# EAGLE design ds32djg (EAGLE 4.11)

## Sheet 1 of 2
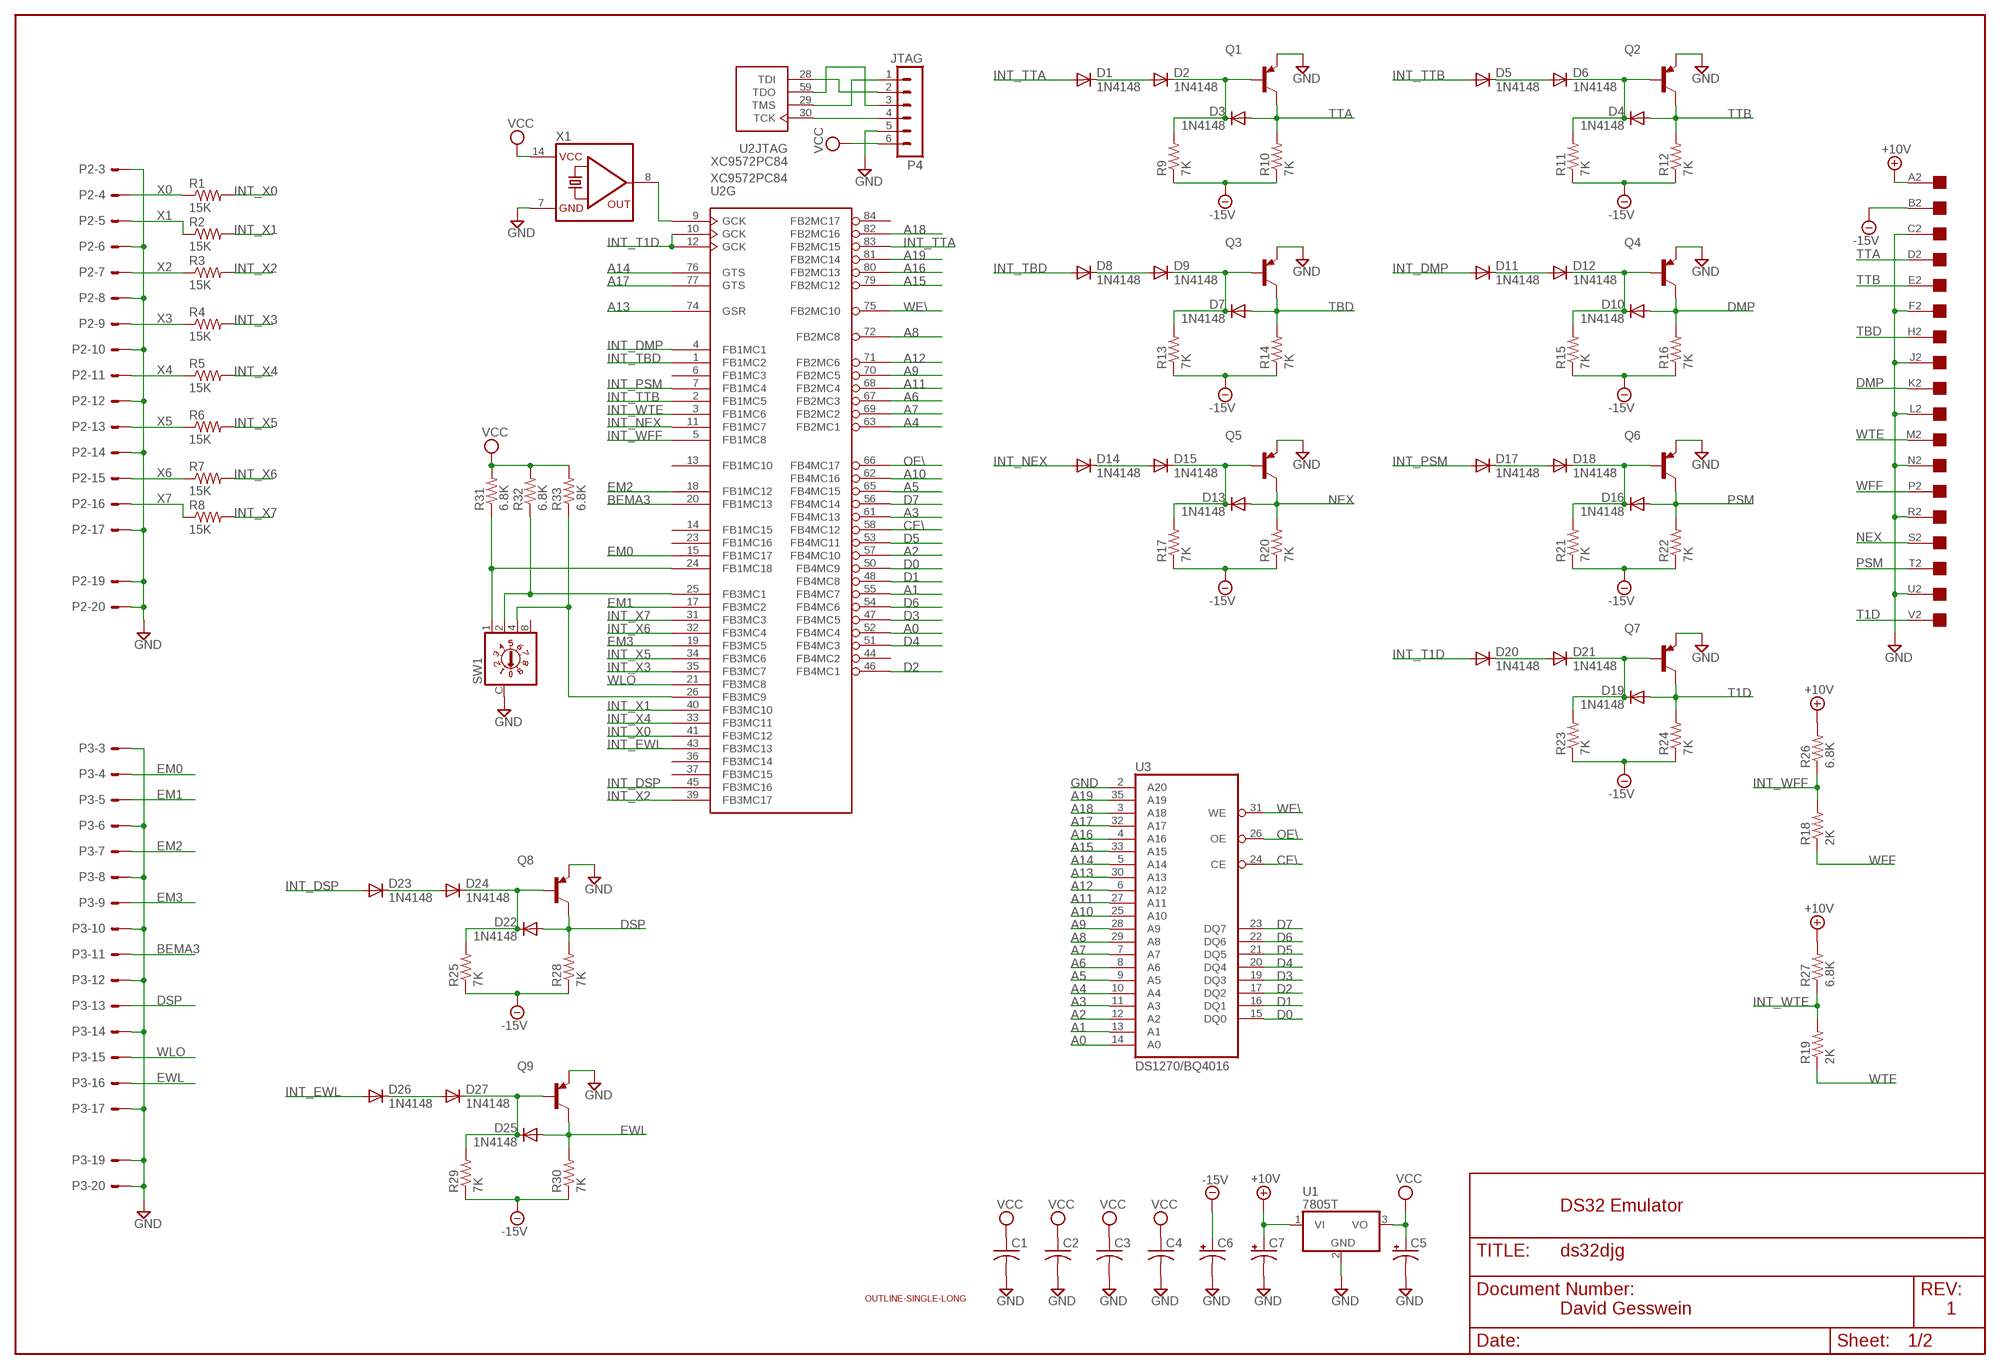
[diagram p0: schematic, sheet 1]

### Parts
C1  C-US050-025X075  [C050-025X075]
C2  C-US050-025X075  [C050-025X075]
C3  C-US050-025X075  [C050-025X075]
C4  C-US050-025X075  [C050-025X075]
C5  CPOL-USE15-5AXIAL  [E15-5]
C6  CPOL-USE15-5AXIAL  [E15-5]
C7  CPOL-USE15-5AXIAL  [E15-5]
D1  1N4148  [DO35-10]
D2  1N4148  [DO35-10]
D3  1N4148  [DO35-10]
D4  1N4148  [DO35-10]
D5  1N4148  [DO35-10]
D6  1N4148  [DO35-10]
D7  1N4148  [DO35-10]
D8  1N4148  [DO35-10]
D9  1N4148  [DO35-10]
D10  1N4148  [DO35-10]
D11  1N4148  [DO35-10]
D12  1N4148  [DO35-10]
D13  1N4148  [DO35-10]
D14  1N4148  [DO35-10]
D15  1N4148  [DO35-10]
D16  1N4148  [DO35-10]
D17  1N4148  [DO35-10]
D18  1N4148  [DO35-10]
D19  1N4148  [DO35-10]
D20  1N4148  [DO35-10]
D21  1N4148  [DO35-10]
D22  1N4148  [DO35-10]
D23  1N4148  [DO35-10]
D24  1N4148  [DO35-10]
D25  1N4148  [DO35-10]
D26  1N4148  [DO35-10]
D27  1N4148  [DO35-10]
P1  EDGE-1  [EDGE-CON1]
P2  ML20E  [ML20]
P3  ML20E  [ML20]
P4  JTAG  MA06-1  [MA06-1]
Q1  -PNP-TO92/  [TO92/]
Q2  -PNP-TO92/  [TO92/]
Q3  -PNP-TO92/  [TO92/]
Q4  -PNP-TO92/  [TO92/]
Q5  -PNP-TO92/  [TO92/]
Q6  -PNP-TO92/  [TO92/]
Q7  -PNP-TO92/  [TO92/]
Q8  -PNP-TO92/  [TO92/]
Q9  -PNP-TO92/  [TO92/]
R1  15K  R-US_0207/10  [0207/10]
R2  15K  R-US_0207/10  [0207/10]
R3  15K  R-US_0207/10  [0207/10]
R4  15K  R-US_0207/10  [0207/10]
R5  15K  R-US_0207/10  [0207/10]
R6  15K  R-US_0207/10  [0207/10]
R7  15K  R-US_0207/10  [0207/10]
R8  15K  R-US_0207/10  [0207/10]
R9  7K  R-US_0207/10  [0207/10]
R10  7K  R-US_0207/10  [0207/10]
R11  7K  R-US_0207/10  [0207/10]
R12  7K  R-US_0207/10  [0207/10]
R13  7K  R-US_0207/10  [0207/10]
R14  7K  R-US_0207/10  [0207/10]
R15  7K  R-US_0207/10  [0207/10]
R16  7K  R-US_0207/10  [0207/10]
R17  7K  R-US_0207/10  [0207/10]
R18  2K  R-US_0207/10  [0207/10]
R19  2K  R-US_0207/10  [0207/10]
R20  7K  R-US_0207/10  [0207/10]
R21  7K  R-US_0207/10  [0207/10]
R22  7K  R-US_0207/10  [0207/10]
R23  7K  R-US_0207/10  [0207/10]
R24  7K  R-US_0207/10  [0207/10]
R25  7K  R-US_0207/10  [0207/10]
R26  6.8K  R-US_0207/10  [0207/10]
R27  6.8K  R-US_0207/10  [0207/10]
R28  7K  R-US_0207/10  [0207/10]
R29  7K  R-US_0207/10  [0207/10]
R30  7K  R-US_0207/10  [0207/10]
R31  6.8K  R-US_0207/10  [0207/10]
R32  6.8K  R-US_0207/10  [0207/10]
R33  6.8K  R-US_0207/10  [0207/10]
SW1  DRR3010  [DRR3010]
U1  7805T  [TO220H]
U2  XC9572PC84  [PLCC-S84]
U3  DS1270/BQ4016  DS1270  [MIL740EXT36]
U$3  OUTLINE-SINGLE-LONG  [SINGLE-LONG]
X1  QG5860  [DIL14S]

### Nets
+10V [power]: C7.+ P1.A2 R26.2 R27.2 U1.1(VI)
-15V [power]: C6.+ P1.B2 R9.1 R10.1 R11.1 R12.1 R13.1 R14.1 R15.1 R16.1 R17.1 R20.1 R21.1 R22.1 R23.1 R24.1 R25.1 R28.1 R29.1 R30.1
A0 [power]: U2.52(G:FB4MC4) U3.14(A0)
A1 [power]: U2.55(G:FB4MC7) U3.13(A1)
A2 [power]: U2.57(G:FB4MC10) U3.12(A2)
A3 [power]: U2.61(G:FB4MC13) U3.11(A3)
A4 [power]: U2.63(G:FB2MC1) U3.10(A4)
A5 [power]: U2.65(G:FB4MC15) U3.9(A5)
A6 [power]: U2.67(G:FB2MC3) U3.8(A6)
A7 [power]: U2.69(G:FB2MC2) U3.7(A7)
A8 [power]: U2.72(G:FB2MC8) U3.29(A8)
A9 [power]: U2.70(G:FB2MC5) U3.28(A9)
A10 [power]: U2.62(G:FB4MC16) U3.25(A10)
A11 [power]: U2.68(G:FB2MC4) U3.27(A11)
A12 [power]: U2.71(G:FB2MC6) U3.6(A12)
A13 [power]: U2.74(G:GSR) U3.30(A13)
A14 [power]: U2.76(G:GTS) U3.5(A14)
A15 [power]: U2.79(G:FB2MC12) U3.33(A15)
A16 [power]: U2.80(G:FB2MC13) U3.4(A16)
A17 [power]: U2.77(G:GTS) U3.32(A17)
A18 [power]: U2.82(G:FB2MC16) U3.3(A18)
A19 [power]: U2.81(G:FB2MC14) U3.35(A19)
BEMA3: P3.11 U2.20(G:FB1MC13)
CE\ [power]: U2.58(G:FB4MC12) U3.24(CE)
D0 [power]: U2.50(G:FB4MC9) U3.15(DQ0)
D1 [power]: U2.48(G:FB4MC8) U3.16(DQ1)
D2 [power]: U2.46(G:FB4MC1) U3.17(DQ2)
D3 [power]: U2.47(G:FB4MC5) U3.19(DQ3)
D4 [power]: U2.51(G:FB4MC3) U3.20(DQ4)
D5 [power]: U2.53(G:FB4MC11) U3.21(DQ5)
D6 [power]: U2.54(G:FB4MC6) U3.22(DQ6)
D7 [power]: U2.56(G:FB4MC14) U3.23(DQ7)
DMP: D10.A P1.K2 Q4.3(C) R16.2
DSP: D22.A P3.13 Q8.3(C) R28.2
EM0: P3.4 U2.15(G:FB1MC17)
EM1: P3.5 U2.17(G:FB3MC2)
EM2: P3.7 U2.18(G:FB1MC12)
EM3: P3.9 U2.19(G:FB3MC5)
EWL: D25.A P3.16 Q9.3(C) R30.2
GND [power]: C1.2 C2.2 C3.2 C4.2 C5.- C6.- C7.- P1.C2 P1.F2 P1.J2 P1.L2 P1.N2 P1.R2 P1.U2 P2.3 P2.6 P2.8 P2.10 P2.12 P2.14 P2.17 P2.19 P2.20 P3.3 P3.6 P3.8 P3.10 P3.12 P3.14 P3.17 P3.19 P3.20 P4.5 Q1.1(E) Q2.1(E) Q3.1(E) Q4.1(E) Q5.1(E) Q6.1(E) Q7.1(E) Q8.1(E) Q9.1(E) SW1.C U1.2(GND) U3.2(A20) X1.7(GND)
INT_DMP: D11.A U2.4(G:FB1MC1)
INT_DSP [power]: D23.A U2.45(G:FB3MC16)
INT_EWL [power]: D26.A U2.43(G:FB3MC13)
INT_NEX: D14.A U2.11(G:FB1MC7)
INT_PSM: D17.A U2.7(G:FB1MC4)
INT_T1D: D20.A U2.10(G:GCK) U2.12(G:GCK)
INT_TBD: D8.A U2.1(G:FB1MC2)
INT_TTA: D1.A U2.83(G:FB2MC15)
INT_TTB: D5.A U2.2(G:FB1MC5)
INT_WFF: R18.2 R26.1 U2.5(G:FB1MC8)
INT_WTE: R19.2 R27.1 U2.3(G:FB1MC6)
INT_X0 [power]: R1.2 U2.41(G:FB3MC12)
INT_X1 [power]: R2.2 U2.40(G:FB3MC10)
INT_X2 [power]: R3.2 U2.39(G:FB3MC17)
INT_X3 [power]: R4.2 U2.35(G:FB3MC7)
INT_X4 [power]: R5.2 U2.33(G:FB3MC11)
INT_X5 [power]: R6.2 U2.34(G:FB3MC6)
INT_X6 [power]: R7.2 U2.32(G:FB3MC4)
INT_X7 [power]: R8.2 U2.31(G:FB3MC3)
N$1 [power]: P4.1 U2.29(JTAG:TMS)
N$2 [power]: P4.2 U2.28(JTAG:TDI)
N$3 [power]: P4.4 U2.30(JTAG:TCK)
N$4 [power]: P4.3 U2.59(JTAG:TDO)
N$5 [power]: U2.9(G:GCK) X1.8(OUT)
N$6 [power]: D1.C D2.A
N$7 [power]: D2.C D3.C Q1.2(B) R9.2
N$8 [power]: D23.C D24.A
N$9 [power]: D22.C D24.C Q8.2(B) R25.2
N$10 [power]: D5.C D6.A
N$11 [power]: D4.C D6.C Q2.2(B) R11.2
N$12 [power]: D26.C D27.A
N$13 [power]: D25.C D27.C Q9.2(B) R29.2
N$14 [power]: D8.C D9.A
N$15 [power]: D7.C D9.C Q3.2(B) R13.2
N$17 [power]: R31.1 SW1.1 U2.24(G:FB1MC18)
N$18 [power]: D11.C D12.A
N$19 [power]: D10.C D12.C Q4.2(B) R15.2
N$20 [power]: R32.1 SW1.2 U2.25(G:FB3MC1)
N$21 [power]: R33.1 SW1.4 U2.26(G:FB3MC9)
N$22 [power]: D14.C D15.A
N$23 [power]: D13.C D15.C Q5.2(B) R17.2
N$26 [power]: D17.C D18.A
N$27 [power]: D16.C D18.C Q6.2(B) R21.2
N$30 [power]: D20.C D21.A
N$31 [power]: D19.C D21.C Q7.2(B) R23.2
NEX: D13.A P1.S2 Q5.3(C) R20.2
OE\ [power]: U2.66(G:FB4MC17) U3.26(OE)
PSM: D16.A P1.T2 Q6.3(C) R22.2
T1D: D19.A P1.V2 Q7.3(C) R24.2
TBD: D7.A P1.H2 Q3.3(C) R14.2
TTA: D3.A P1.D2 Q1.3(C) R10.2
TTB: D4.A P1.E2 Q2.3(C) R12.2
VCC [power]: C1.1 C2.1 C3.1 C4.1 C5.+ P4.6 R31.2 R32.2 R33.2 U1.3(VO) X1.14(VCC)
WE\ [power]: U2.75(G:FB2MC10) U3.31(WE)
WFF: P1.P2 R18.1
WLO: P3.15 U2.21(G:FB3MC8)
WTE: P1.M2 R19.1
X0: P2.4 R1.1
X1: P2.5 R2.1
X2: P2.7 R3.1
X3: P2.9 R4.1
X4: P2.11 R5.1
X5: P2.13 R6.1
X6: P2.15 R7.1
X7: P2.16 R8.1
Unconnected: P2.1 P2.2 P2.18 P3.1 P3.2 P3.18 SW1.8 U2.6(G:FB1MC3) U2.13(G:FB1MC10) U2.14(G:FB1MC15) U2.23(G:FB1MC16) U2.36(G:FB3MC14) U2.37(G:FB3MC15) U2.44(G:FB4MC2) U2.84(G:FB2MC17)

### Notes on the sheet
- DS32 Emulator
- David Gesswein | 1

## Sheet 2 of 2
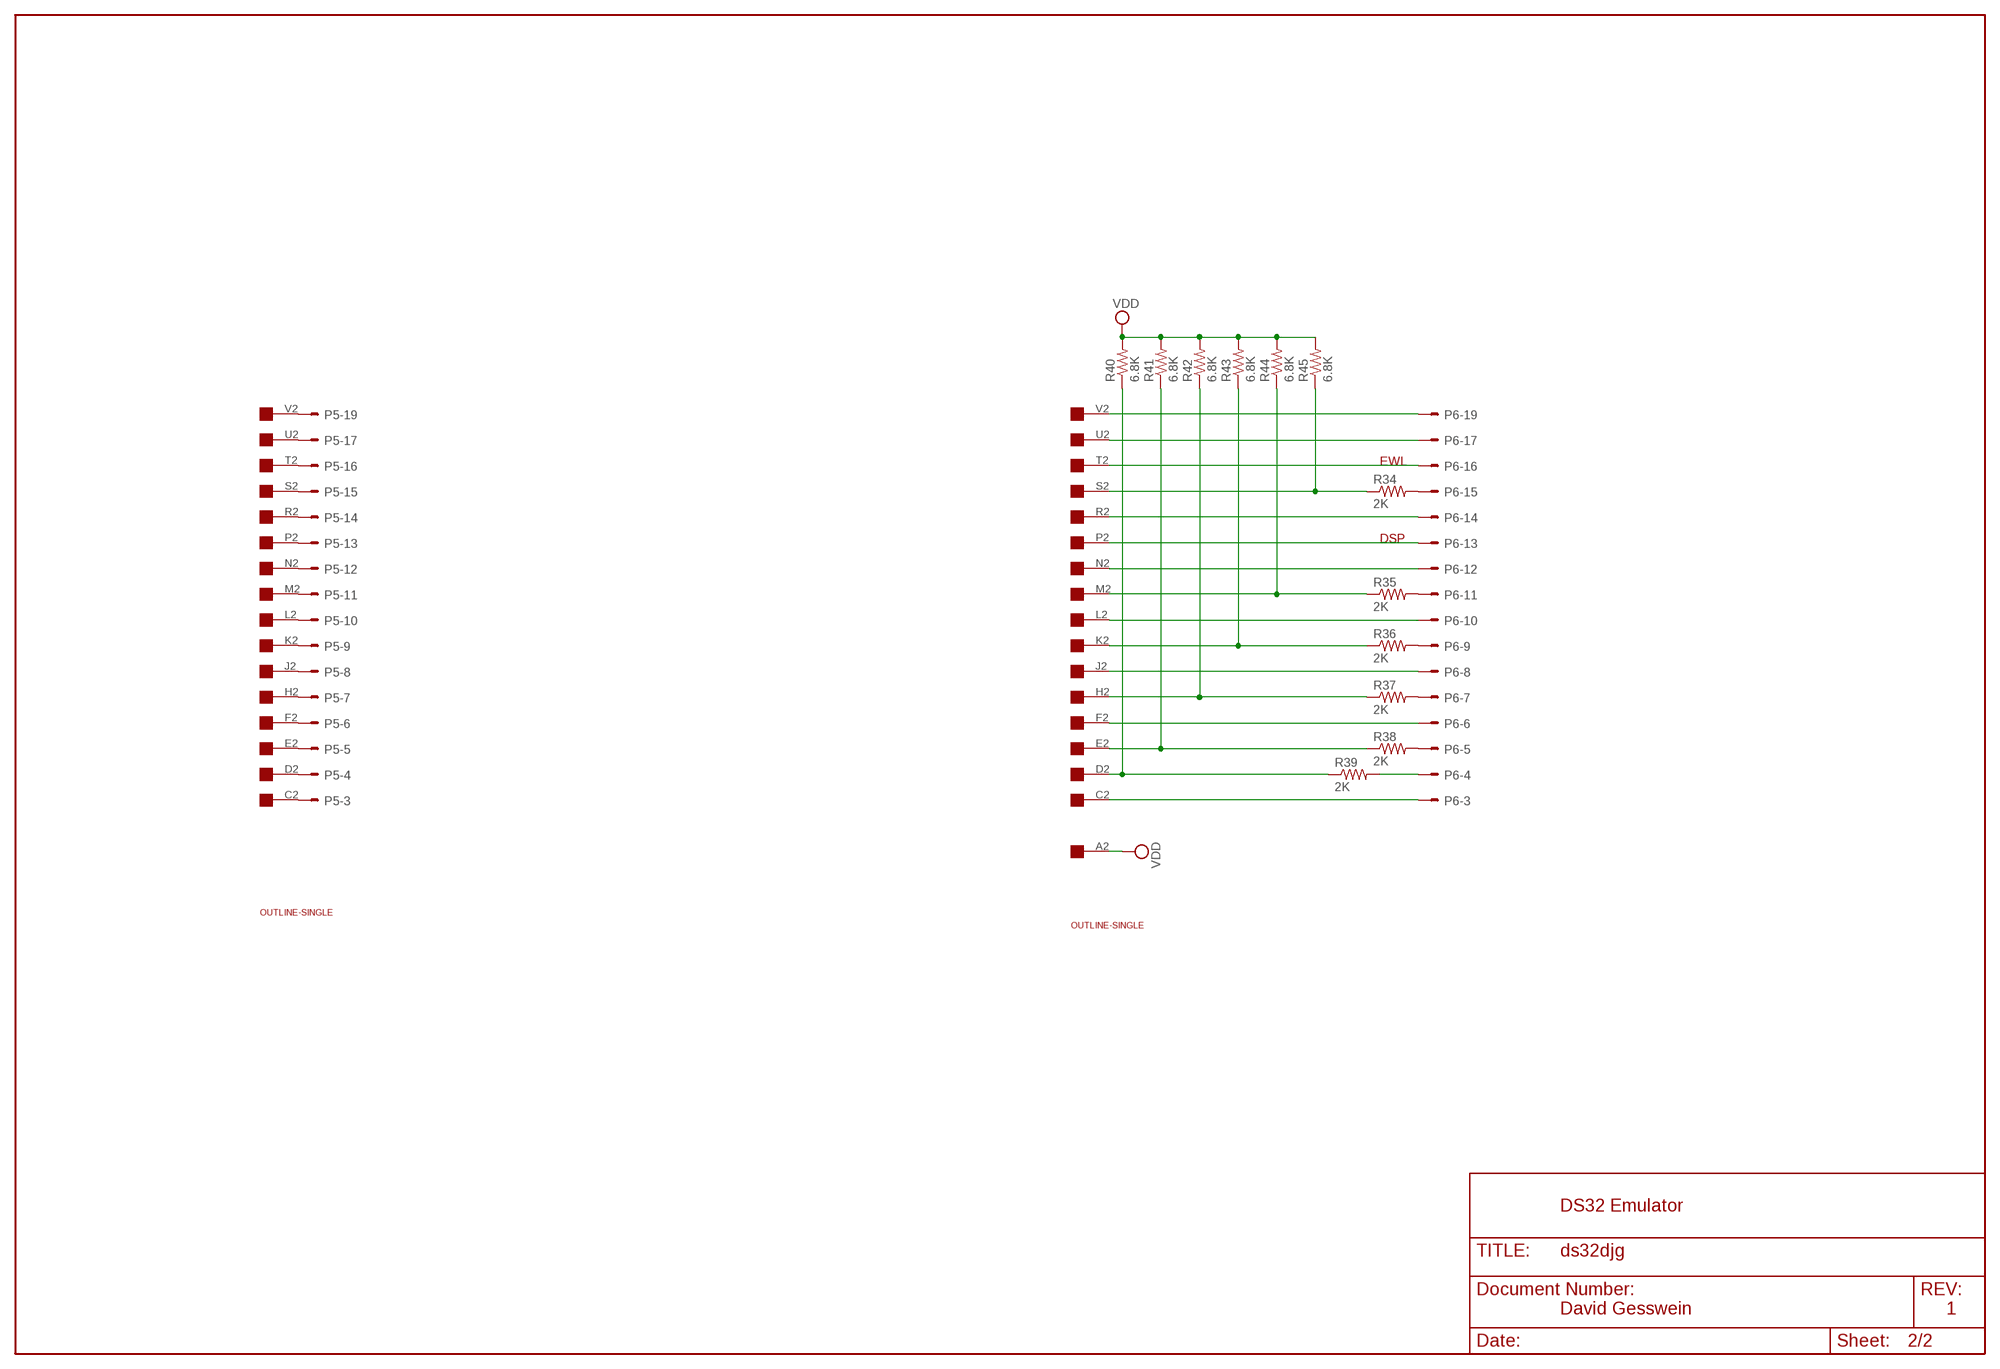
[diagram p1: schematic, sheet 2]

### Parts
P5  ML20E  [ML20]
P6  ML20E  [ML20]
R34  2K  R-US_0207/10  [0207/10]
R35  2K  R-US_0207/10  [0207/10]
R36  2K  R-US_0207/10  [0207/10]
R37  2K  R-US_0207/10  [0207/10]
R38  2K  R-US_0207/10  [0207/10]
R39  2K  R-US_0207/10  [0207/10]
R40  6.8K  R-US_0207/10  [0207/10]
R41  6.8K  R-US_0207/10  [0207/10]
R42  6.8K  R-US_0207/10  [0207/10]
R43  6.8K  R-US_0207/10  [0207/10]
R44  6.8K  R-US_0207/10  [0207/10]
R45  6.8K  R-US_0207/10  [0207/10]
U$1  EDGE-1  [EDGE-CON1]
U$2  EDGE-1  [EDGE-CON1]
U$4  OUTLINE-SINGLE  [SINGLE]
U$5  OUTLINE-SINGLE  [SINGLE]

### Nets
N$16 [power]: P6.3 U$2.C2
N$24 [power]: P5.3 U$1.C2
N$25 [power]: P5.4 U$1.D2
N$28 [power]: P5.5 U$1.E2
N$29 [power]: P5.6 U$1.F2
N$32 [power]: P5.7 U$1.H2
N$33 [power]: P5.8 U$1.J2
N$34 [power]: P5.9 U$1.K2
N$35 [power]: P5.10 U$1.L2
N$36 [power]: P5.11 U$1.M2
N$37 [power]: P5.12 U$1.N2
N$38 [power]: P5.13 U$1.P2
N$39 [power]: P5.14 U$1.R2
N$40 [power]: P5.15 U$1.S2
N$41 [power]: P5.16 U$1.T2
N$42 [power]: P5.17 U$1.U2
N$43 [power]: P5.19 U$1.V2
N$44 [power]: P6.6 U$2.F2
N$45 [power]: P6.8 U$2.J2
N$46 [power]: P6.10 U$2.L2
N$47 [power]: P6.12 U$2.N2
N$48 [power]: P6.14 U$2.R2
N$49 [power]: P6.19 U$2.V2
N$50 [power]: P6.17 U$2.U2
N$51 [power]: P6.16 U$2.T2
N$52 [power]: P6.13 U$2.P2
N$53 [power]: P6.15 R34.2
N$54 [power]: P6.11 R35.2
N$55 [power]: P6.9 R36.2
N$56 [power]: P6.7 R37.2
N$57 [power]: P6.5 R38.2
N$58 [power]: P6.4 R39.2
N$59 [power]: R39.1 R40.1 U$2.D2
N$60 [power]: R38.1 R41.1 U$2.E2
N$61 [power]: R37.1 R42.1 U$2.H2
N$62 [power]: R36.1 R43.1 U$2.K2
N$63 [power]: R35.1 R44.1 U$2.M2
N$64 [power]: R34.1 R45.1 U$2.S2
VDD [power]: R40.2 R41.2 R42.2 R43.2 R44.2 R45.2 U$2.A2
Unconnected: P5.1 P5.2 P5.18 P5.20 P6.1 P6.2 P6.18 P6.20 U$1.A2 U$1.B2 U$2.B2

### Notes on the sheet
- EWL
- DSP
- DS32 Emulator
- David Gesswein | 1

## Power pins joined to a net without a drawn wire
GND: U2.8(P:GND) U2.16(P:GND) U2.27(P:GND) U2.42(P:GND) U2.49(P:GND) U2.60(P:GND) U3.18(GND)
VCC: U2.22(P:VCC) U2.38(P:VCC) U2.64(P:VCC) U2.73(P:VCC) U2.78(P:VCC) U3.36(VCC)

## Library data of the parts
C1-C4 = rcl:C-US: CAPACITOR, American symbol
C5-C7 = rcl:CPOL-US: POLARIZED CAPACITOR, American symbol
D1-D27 = diode:1N4148: DIODE high speed (Philips)
P1 U$1 U$2 = dec-con:EDGE-1: Single-Sided DEC Edge Connector -- (side 2)
P2 P3 P5 P6 = con-harting-ml:ML20?E: HARTING
P4 = con-lstb:MA06-1: PIN HEADER
Q1-Q9 = transistor:*-PNP-: PNP Transistror
R1-R45 = rcl:R-US_: RESISTOR, American symbol
SW1 = switch-dil:DRR3010: DIL/CODE SWITCH
U1 = linear:78*: Positive VOLTAGE REGULATOR
U2 = xl_cpld:XC9572PC84
U3 = maxim-7:DS1270: DS1270 and similar NVRAM
U$3-U$5 = dec-con:OUTLINE-*: Board outlines for DEC boards.
X1 = crystal:QG5860: CRYSTAL RESONATOR

## Net classes
1 power: width 0.508 mm

## Board
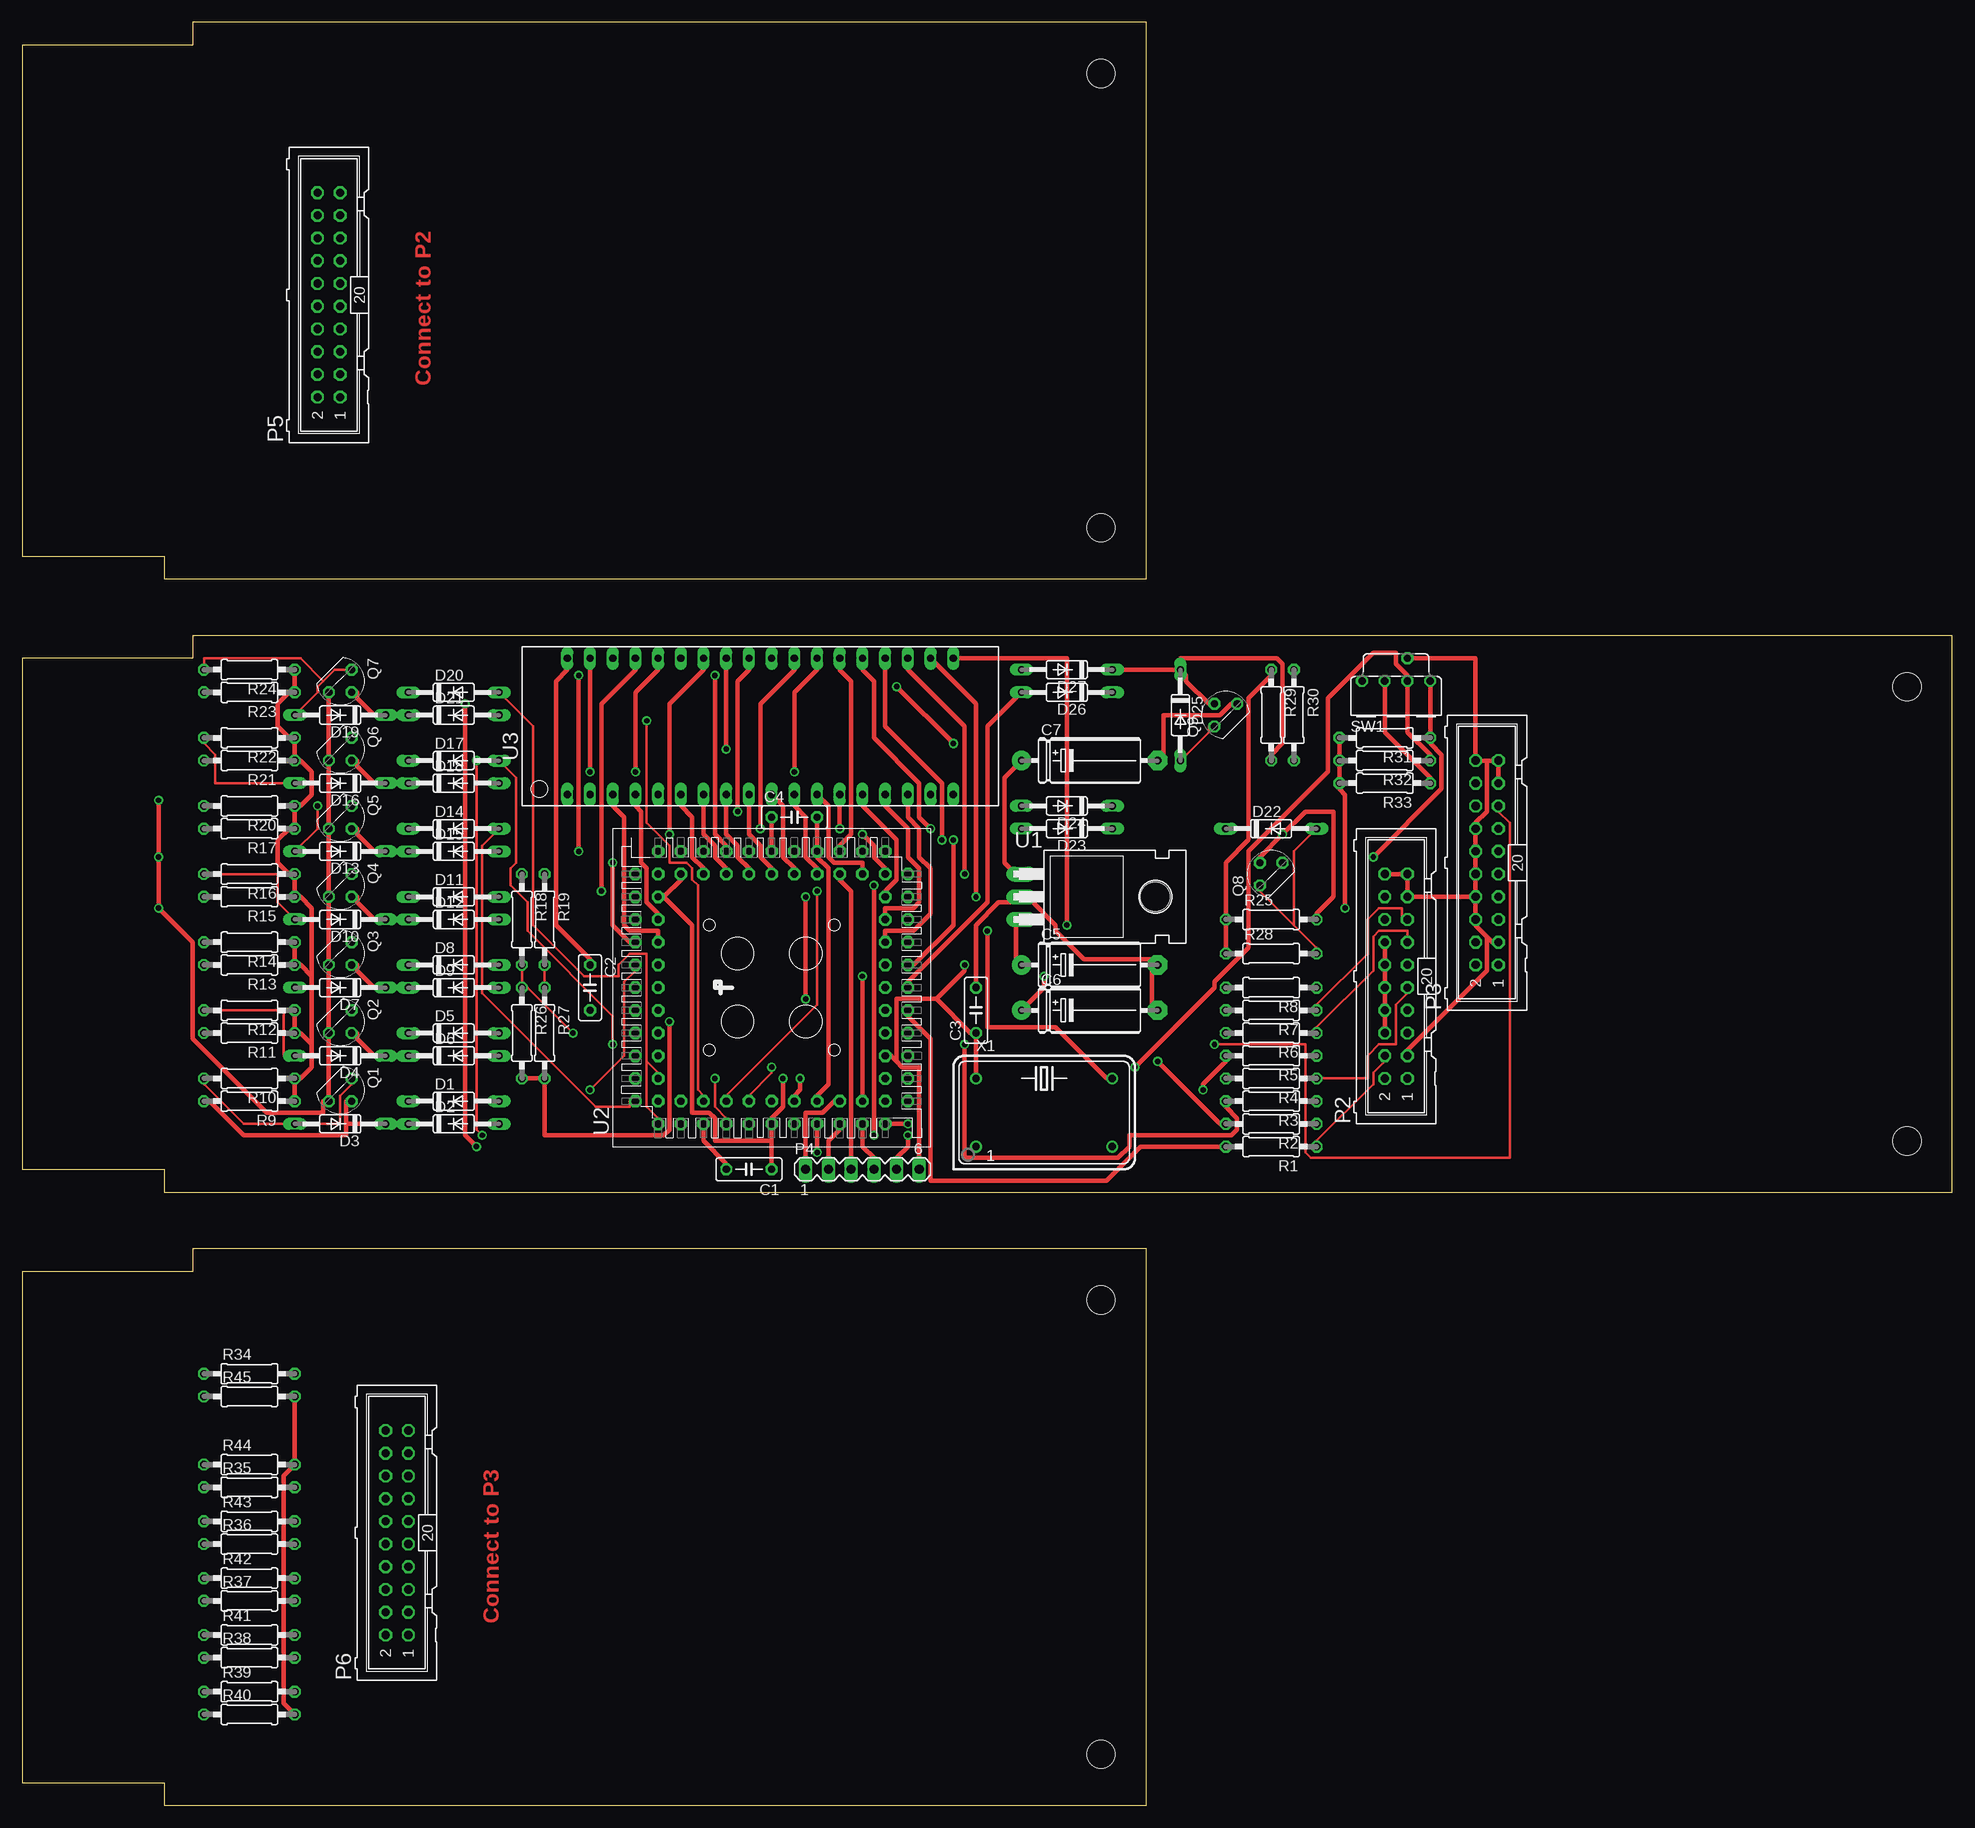
[diagram p2: board, top side]
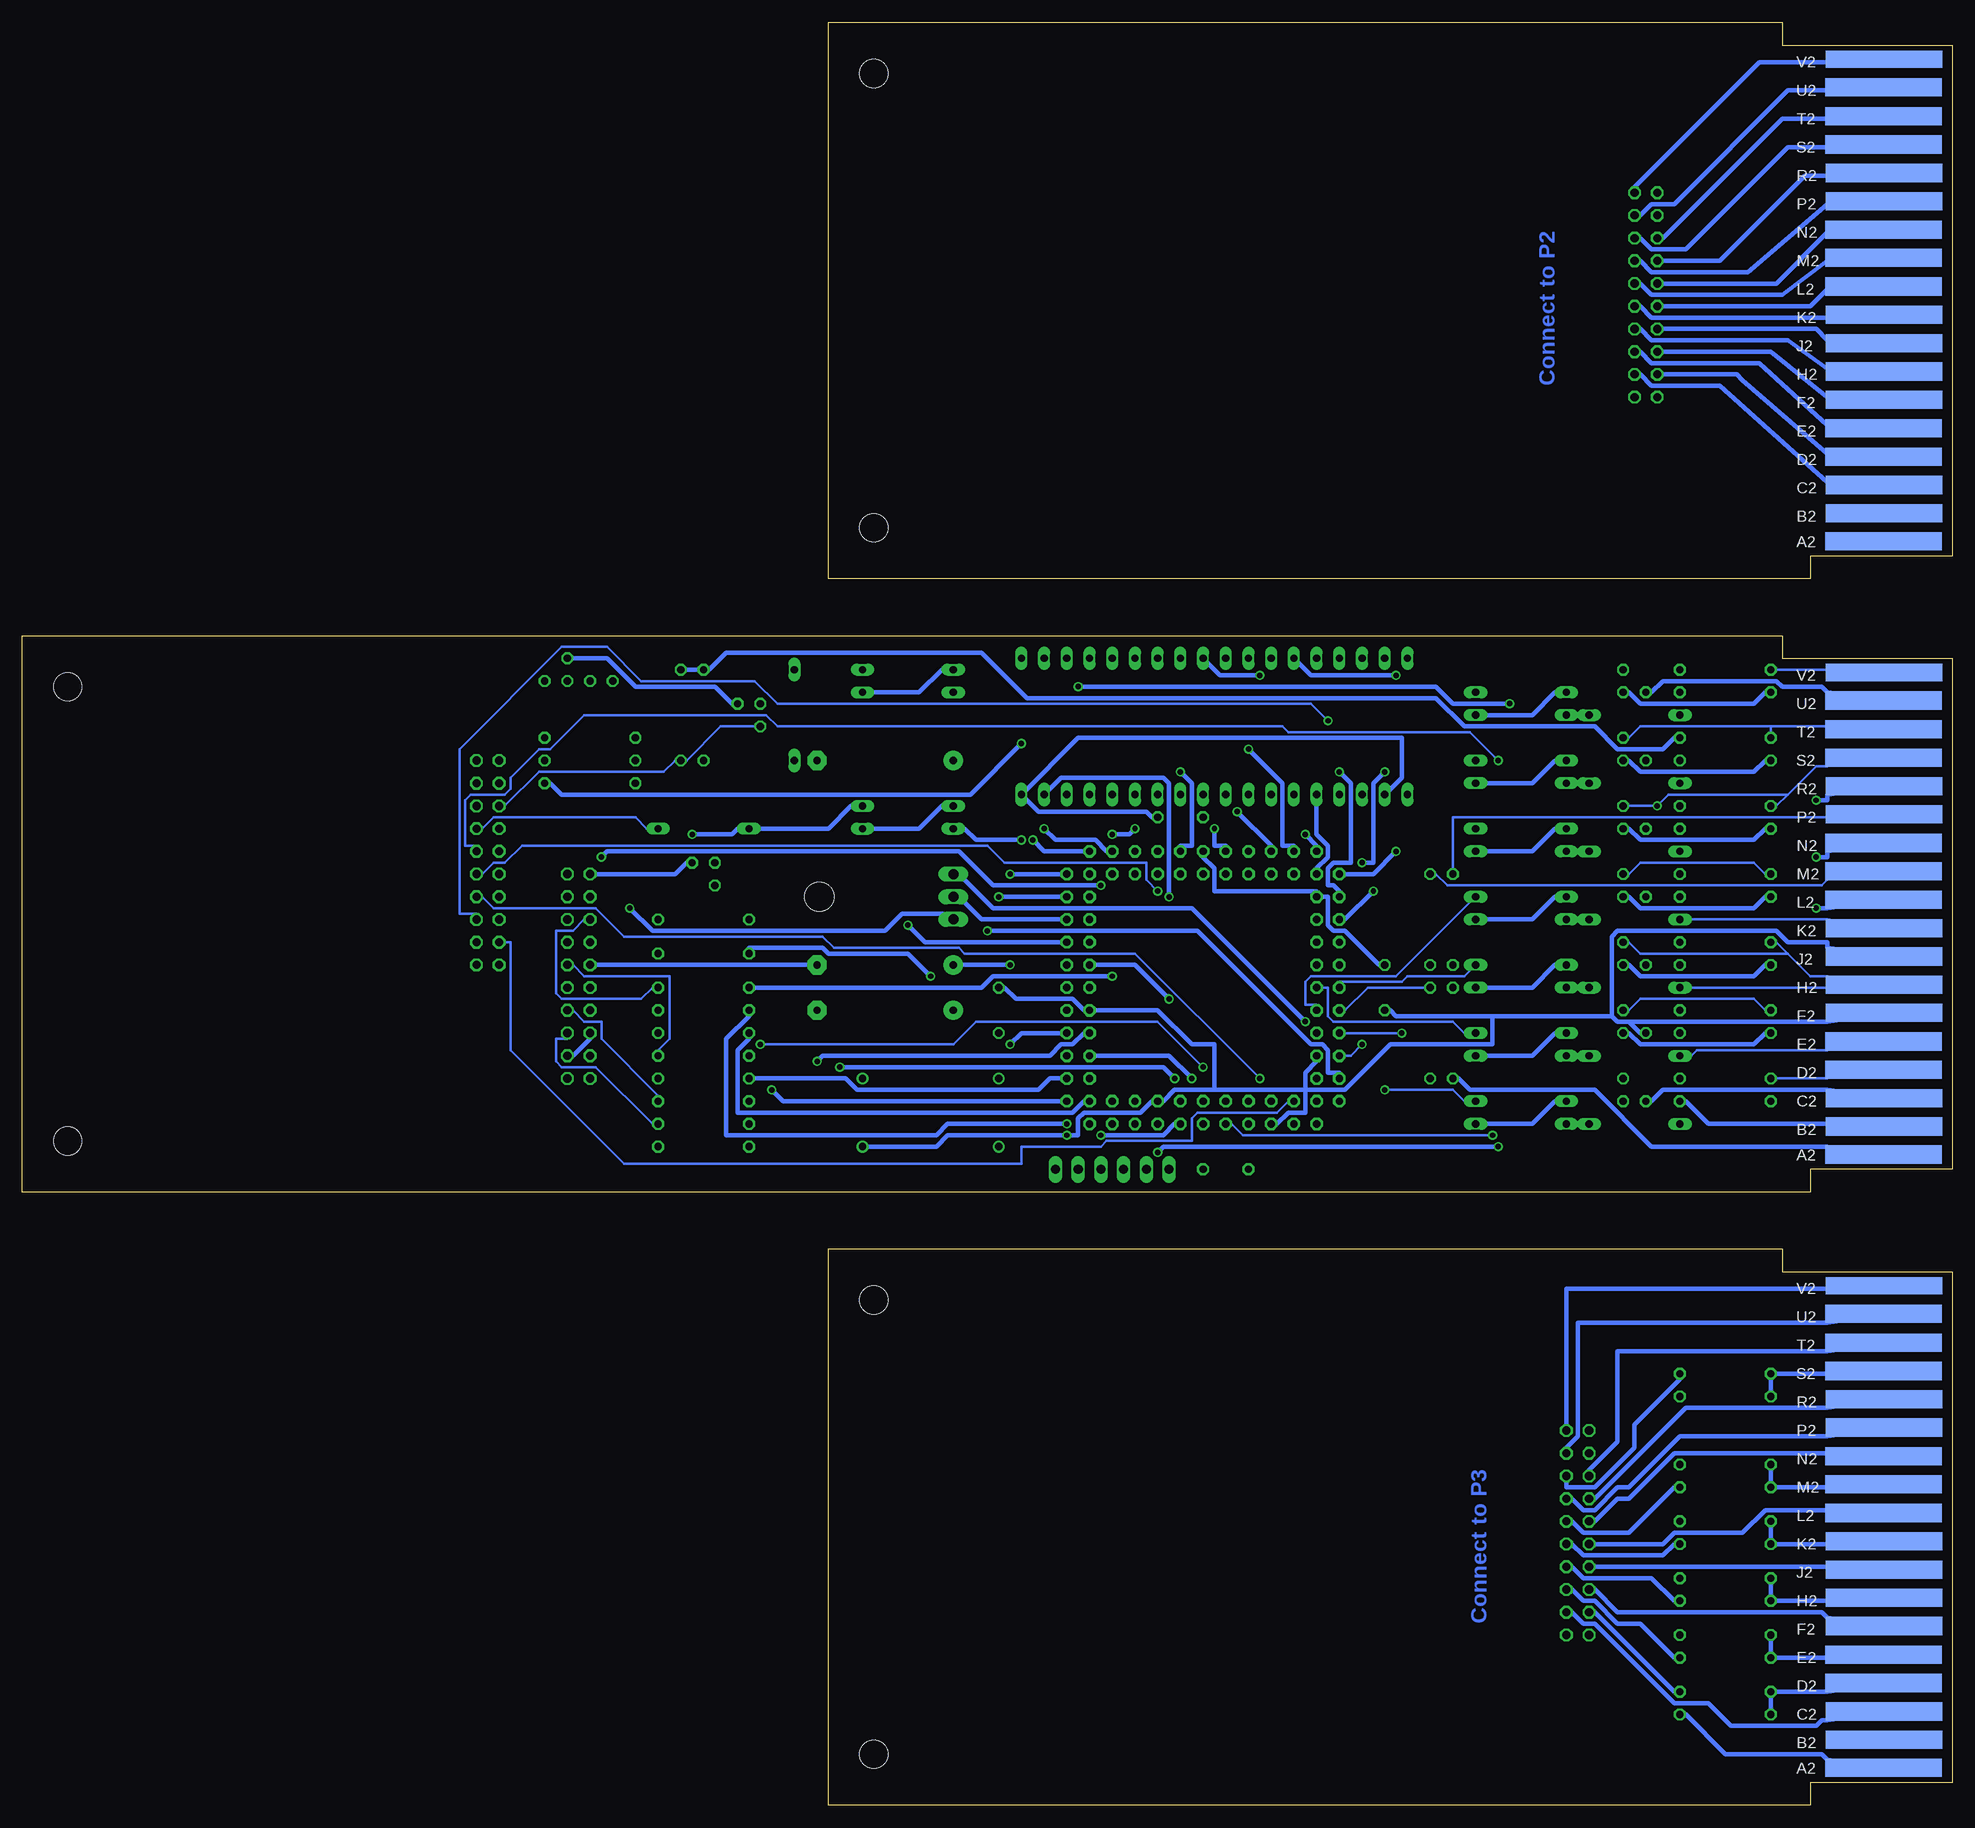
[diagram p3: board, bottom side, seen from below]

Size 215.9 x 199.39 mm. Coordinates in mm from the lower left corner, seen from the top.
Copper layers (1*16): Top 0.035mm / dielectric 1.5mm / Bottom 0.035mm
Design rules "10mils": minimum track width 10mil, minimum drill 24mil, track to track 10mil, track to pad 10mil, pad to pad 10mil, via to via 10mil, smd to smd 10mil, copper to edge 25mil, drill to drill 10mil, minimum pad ring 10mil, minimum via ring 8mil, stop-mask expansion 0mil, vias tented up to drill 0mil, thermal gap 10mil

### Footprints (pad centres in the part's own frame; a part is rotated, then mirrored left to right if it is on the bottom)
C050-025X075 = drill 0.813 octagon: 1 -2.54,0; 2 2.54,0
E15-5 = drill 0.813 pad 2.159 round: + -7.62,0 | drill 0.813 pad 2.159 octagon: - 7.62,0
DO35-10 = drill 0.813 long: A 5.08,0; C -5.08,0
EDGE-CON1 = smd 13.017 x 2.032 bottom: A2 7.69,4.194; B2 7.668,7.328; C2 7.668,10.49; D2 7.693,13.665; E2 7.693,16.84; F2 7.642,20.041; H2 7.642,23.19; J2 7.668,26.34; K2 7.668,29.515; L2 7.693,32.69; M2 7.693,35.89; N2 7.693,39.04; P2 7.668,42.24; R2 7.668,45.39; S2 7.693,48.565; T2 7.693,51.74; U2 7.693,54.966 | smd 13.017 x 1.905 bottom: V2 7.668,58.102
ML20 = drill 0.914 octagon: 1 -11.43,-1.27; 2 -11.43,1.27; 3 -8.89,-1.27; 4 -8.89,1.27; 5 -6.35,-1.27; 6 -6.35,1.27; 7 -3.81,-1.27; 8 -3.81,1.27; 9 -1.27,-1.27; 10 -1.27,1.27; 11 1.27,-1.27; 12 1.27,1.27; 13 3.81,-1.27; 14 3.81,1.27; 15 6.35,-1.27; 16 6.35,1.27; 17 8.89,-1.27; 18 8.89,1.27; 19 11.43,-1.27; 20 11.43,1.27
MA06-1 = drill 1.016 long: 1 -6.35,0; 2 -3.81,0; 3 -1.27,0; 4 1.27,0; 5 3.81,0; 6 6.35,0
TO92/ = drill 0.813 octagon: 1 1.27,-1.27; 2 1.27,1.27; 3 -1.27,1.27
0207/10 = drill 0.813 octagon: 1 -5.08,0; 2 5.08,0
DRR3010 = drill 0.813 octagon: 1 3.81,0; 2 1.27,0; 4 -1.27,0; 8 -3.81,0; C 1.27,2.54
TO220H = drill 1.118 long: 1 -2.54,-10.16; 2 0,-10.16; 3 2.54,-10.16 | hole 3.302: 0,4.826
PLCC-S84 = drill 0.813 pad 1.397 octagon: 1 0,15.24; 2 0,12.7; 3 -2.54,15.24; 4 -2.54,12.7; 5 -5.08,15.24; 6 -5.08,12.7; 7 -7.62,15.24; 8 -7.62,12.7; 9 -10.16,15.24; 10 -10.16,12.7; 11 -12.7,15.24; 12 -15.24,12.7; 13 -12.7,12.7; 14 -15.24,10.16; 15 -12.7,10.16; 16 -15.24,7.62; 17 -12.7,7.62; 18 -15.24,5.08; 19 -12.7,5.08; 20 -15.24,2.54; 21 -12.7,2.54; 22 -15.24,0; 23 -12.7,0; 24 -15.24,-2.54; 25 -12.7,-2.54; 26 -15.24,-5.08; 27 -12.7,-5.08; 28 -15.24,-7.62; 29 -12.7,-7.62; 30 -15.24,-10.16; 31 -12.7,-10.16; 32 -15.24,-12.7; 33 -12.7,-15.24; 34 -12.7,-12.7; 35 -10.16,-15.24; 36 -10.16,-12.7; 37 -7.62,-15.24; 38 -7.62,-12.7; 39 -5.08,-15.24; 40 -5.08,-12.7; 41 -2.54,-15.24; 42 -2.54,-12.7; 43 0,-15.24; 44 0,-12.7; 45 2.54,-15.24; 46 2.54,-12.7; 47 5.08,-15.24; 48 5.08,-12.7; 49 7.62,-15.24; 50 7.62,-12.7; 51 10.16,-15.24; 52 10.16,-12.7; 53 12.7,-15.24; 54 15.24,-12.7; 55 12.7,-12.7; 56 15.24,-10.16; 57 12.7,-10.16; 58 15.24,-7.62; 59 12.7,-7.62; 60 15.24,-5.08; 61 12.7,-5.08; 62 15.24,-2.54; 63 12.7,-2.54; 64 15.24,0; 65 12.7,0; 66 15.24,2.54; 67 12.7,2.54; 68 15.24,5.08; 69 12.7,5.08; 70 15.24,7.62; 71 12.7,7.62; 72 15.24,10.16; 73 12.7,10.16; 74 15.24,12.7; 75 12.7,15.24; 76 12.7,12.7; 77 10.16,15.24; 78 10.16,12.7; 79 7.62,15.24; 80 7.62,12.7; 81 5.08,15.24; 82 5.08,12.7; 83 2.54,15.24; 84 2.54,12.7
MIL740EXT36 = drill 0.813 long: 1 -20.32,-7.62; 2 -17.78,-7.62; 3 -15.24,-7.62; 4 -12.7,-7.62; 5 -10.16,-7.62; 6 -7.62,-7.62; 7 -5.08,-7.62; 8 -2.54,-7.62; 9 0,-7.62; 10 2.54,-7.62; 11 5.08,-7.62; 12 7.62,-7.62; 13 10.16,-7.62; 14 12.7,-7.62; 15 15.24,-7.62; 16 17.78,-7.62; 17 20.32,-7.62; 18 22.86,-7.62; 19 22.86,7.62; 20 20.32,7.62; 21 17.78,7.62; 22 15.24,7.62; 23 12.7,7.62; 24 10.16,7.62; 25 7.62,7.62; 26 5.08,7.62; 27 2.54,7.62; 28 0,7.62; 29 -2.54,7.62; 30 -5.08,7.62; 31 -7.62,7.62; 32 -10.16,7.62; 33 -12.7,7.62; 34 -15.24,7.62; 35 -17.78,7.62; 36 -20.32,7.62
SINGLE-LONG = hole 3.175: 210.82,56.515; 210.82,5.715
SINGLE = hole 3.175: 120.65,56.515; 120.65,5.715
DIL14S = drill 0.813 round: 1 -7.62,-3.81; 7 7.62,-3.81; 8 7.62,3.81; 14 -7.62,3.81

### Placement (x,y rotation side)
C1  81.28,71.12 180 top
C2  63.5,91.44 270 top
C3  106.68,88.9 90 top
C4  86.36,110.49 0 top
C5  119.38,93.98 0 top
C6  119.38,88.9 0 top
C7  119.38,116.84 0 top
D1  48.26,78.74 0 top
D2  48.26,76.2 0 top
D3  35.56,76.2 180 top
D4  35.56,83.82 180 top
D5  48.26,86.36 0 top
D6  48.26,83.82 0 top
D7  35.56,91.44 180 top
D8  48.26,93.98 0 top
D9  48.26,91.44 0 top
D10  35.56,99.06 180 top
D11  48.26,101.6 0 top
D12  48.26,99.06 0 top
D13  35.56,106.68 180 top
D14  48.26,109.22 0 top
D15  48.26,106.68 0 top
D16  35.56,114.3 180 top
D17  48.26,116.84 0 top
D18  48.26,114.3 0 top
D19  35.56,121.92 180 top
D20  48.26,124.46 0 top
D21  48.26,121.92 0 top
D22  139.7,109.22 0 top
D23  116.84,109.22 180 top
D24  116.84,111.76 180 top
D25  129.54,121.92 270 top
D26  116.84,124.46 180 top
D27  116.84,127 180 top
P1  0,68.58 0 top
P2  153.67,92.71 90 top
P3  163.83,105.41 90 top
P4  93.98,71.12 0 top
P5  34.29,168.91 90 top
P6  41.91,30.48 90 top
Q1  35.56,80.01 270 top
Q2  35.56,87.63 270 top
Q3  35.56,95.25 270 top
Q4  35.56,102.87 270 top
Q5  35.56,110.49 270 top
Q6  35.56,118.11 270 top
Q7  35.56,125.73 270 top
Q8  139.7,104.14 90 top
Q9  134.62,121.92 90 top
R1  139.7,73.66 180 top
R2  139.7,76.2 180 top
R3  139.7,78.74 180 top
R4  139.7,81.28 180 top
R5  139.7,83.82 180 top
R6  139.7,86.36 180 top
R7  139.7,88.9 180 top
R8  139.7,91.44 180 top
R9  25.4,78.74 180 top
R10  25.4,81.28 180 top
R11  25.4,86.36 180 top
R12  25.4,88.9 180 top
R13  25.4,93.98 180 top
R14  25.4,96.52 180 top
R15  25.4,101.6 180 top
R16  25.4,104.14 180 top
R17  25.4,109.22 180 top
R18  55.88,99.06 270 top
R19  58.42,99.06 270 top
R20  25.4,111.76 180 top
R21  25.4,116.84 180 top
R22  25.4,119.38 180 top
R23  25.4,124.46 180 top
R24  25.4,127 180 top
R25  139.7,99.06 0 top
R26  55.88,86.36 270 top
R27  58.42,86.36 270 top
R28  139.7,95.25 0 top
R29  139.7,121.92 270 top
R30  142.24,121.92 270 top
R31  152.4,119.38 180 top
R32  152.4,116.84 180 top
R33  152.4,114.3 180 top
R34  25.4,48.26 0 top
R35  25.4,35.56 0 top
R36  25.4,29.21 0 top
R37  25.4,22.86 0 top
R38  25.4,16.51 0 top
R39  25.4,12.7 0 top
R40  25.4,10.16 0 top
R41  25.4,19.05 0 top
R42  25.4,25.4 0 top
R43  25.4,31.75 0 top
R44  25.4,38.1 0 top
R45  25.4,45.72 0 top
SW1  153.67,125.73 0 top
U1  121.92,101.6 270 top
U2  83.82,91.44 90 top
U3  81.28,120.65 0 top
U$1  0,137.16 0 top
U$2  0,0 0 top
U$3  0,68.58 0 top
U$4  0,0 0 top
U$5  0,137.16 0 top
X1  114.3,77.47 0 top

### Tracks (layer width: path | path; a pad name or v marks a point on that pad's centre or on a via)
+10V  (via drill 0.61)
  Top 0.508: U1.1 110.49,104.78 109.86,105.41 109.86,114.94 C7.+ | R26.2 R27.2 58.42,74.93 71.76,74.93 72.39,75.56 v72.39,87.63
  Bottom 0.508: R26.2 55.25,81.28 53.98,80.01 40.01,80.01 33.66,73.66 13.97,73.66 P1.A2 | v72.39,87.63 85.09,100.33 107.32,100.33 110.49,103.5 U1.1
-15V  (via drill 0.61)
  Top 0.508: R28.1 R25.1 134.62,105.41 137.16,107.95 137.16,123.82 139.7,126.36 R29.1 | v114.3,92.71 114.3,91.44 C6.+ | R24.1 R23.1 29.85,124.46 28.58,123.19 28.58,120.65 29.85,119.38 R22.1 R21.1 31.12,116.84 32.39,115.57 32.39,113.03 31.12,111.76 R20.1 R17.1 29.85,109.22 28.58,107.95 28.58,105.41 29.85,104.14 R16.1 R15.1 31.12,101.6 32.39,100.33 32.39,92.71 | R14.1 R13.1 31.12,93.98 32.39,92.71 | R9.1 R10.1 31.12,81.28 32.39,82.55 32.39,85.09 | R12.1 R11.1 31.12,86.36 32.39,85.09 | 32.39,85.09 32.39,92.71
  Bottom 0.508: R30.1 R29.1 139.07,127 137.16,128.91 108.59,128.91 103.51,123.82 57.79,123.82 54.61,120.65 40.01,120.65 37.47,118.11 32.39,118.11 31.12,119.38 R22.1 | v114.3,92.71 116.84,95.25 125.73,95.25 126.37,95.88 134.62,95.88 R28.1 | P1.B2 13.97,76.2 27.31,76.2 29.85,78.74 R9.1
A0
  Top 0.508: U3.14 93.98,111.76 97.79,107.95 97.79,103.5 96.52,102.23 U2.52
A1  (via drill 0.61)
  Top 0.508: v93.98,108.59 95.25,107.31 95.25,106.05 96.52,104.78 U2.55 | v91.44,109.22 U3.13
  Bottom 0.508: v91.44,109.22 92.08,108.59 v93.98,108.59
A2
  Top 0.508: U3.12 90.17,111.76 90.17,106.05 90.81,105.41 93.98,105.41 U2.57
A3
  Top 0.508: U3.11 86.36,111.76 87.63,110.49 87.63,106.05 88.9,104.78 U2.61
A4
  Top 0.508: U3.10 85.09,111.76 85.09,106.05 86.36,104.78 U2.63
A5
  Top 0.508: U3.9 81.28,108.59 82.55,107.31 82.55,106.05 83.82,104.78 U2.65
A6
  Top 0.508: U3.8 78.74,108.59 80.01,107.31 80.01,106.05 81.28,104.78 U2.67
A7
  Top 0.508: U3.7 76.2,108.59 77.47,107.31 77.47,106.05 78.74,104.78 U2.69
A8  (via drill 0.61)
  Top 0.508: v78.74,118.11 U3.29
  Bottom 0.508: v78.74,118.11 74.93,114.3 74.93,107.31 73.66,107.31 U2.72
A9  (via drill 0.61)
  Top 0.508: v80.01,111.12 80.01,125.73 81.28,127 U3.28
  Bottom 0.508: v80.01,111.12 76.2,107.31 U2.70
A10  (via drill 0.61)
  Top 0.508: v86.36,115.57 86.36,124.46 88.9,127 U3.25
  Bottom 0.508: v86.36,115.57 85.09,114.3 85.09,107.31 86.36,107.31 U2.62
A11  (via drill 0.61)
  Top 0.508: v77.47,126.36 77.47,108.59 78.74,107.31 U2.68
  Bottom 0.508: v77.47,126.36 81.92,126.36 U3.27
A12
  Top 0.508: U3.6 73.66,111.76 74.93,110.49 74.93,106.05 76.2,104.78 U2.71
A13  (via drill 0.61)
  Top 0.508: v72.39,108.59 72.39,123.19 76.2,127 U3.30
  Bottom 0.508: v72.39,108.59 71.12,107.31 U2.74
A14
  Bottom 0.508: U3.5 71.12,108.59 69.85,107.31 69.85,106.05 71.12,104.78 U2.76
A15  (via drill 0.61)
  Top 0.508: v64.77,102.23 64.77,123.19 68.58,127 U3.33
  Bottom 0.508: v64.77,102.23 67.95,99.06 U2.79
A16
  Top 0.508: U3.4 68.58,111.76 69.22,111.12 69.22,105.41 69.85,104.78 69.85,100.97 71.12,99.69 U2.80
A17  (via drill 0.61)
  Top 0.508: v68.58,115.57 68.58,124.46 71.12,127 U3.32
  Bottom 0.508: v68.58,115.57 67.31,114.3 67.31,105.41 69.22,105.41 69.85,104.78 69.85,102.87 69.22,102.87 68.58,102.23 U2.77
A18
  Top 0.508: U3.3 66.04,111.76 67.31,110.49 67.31,98.42 67.95,97.79 71.12,97.79 U2.82
A19  (via drill 0.61)
  Top 0.508: v66.04,105.41 66.04,98.42 67.95,96.52 U2.81 | v63.5,115.57 U3.35
  Bottom 0.508: v63.5,115.57 64.77,114.3 64.77,105.41 v66.04,105.41
BEMA3  (via drill 0.61)
  Top 0.254: v51.44,74.93 50.8,75.56 v50.8,116.84
  Bottom 0.254: v51.44,74.93 79.38,74.93 80.65,76.2 U2.20 | v50.8,116.84 53.98,120.02 74.3,120.02 74.93,120.65 131.45,120.65 132.72,121.92 153.04,121.92 156.85,118.11 158.12,118.11 161.29,114.94 161.29,113.66 161.93,113.03 165.74,113.03 166.37,112.39 166.37,107.31 165.1,107.31 P3.11
CE\
  Top 0.508: U3.24 91.44,127 92.71,125.73 92.71,108.59 91.44,107.31 U2.58
D0
  Top 0.508: U3.15 96.52,111.76 99.06,109.22 99.06,106.05 100.33,104.78 100.33,100.97 99.7,100.33 96.52,100.33 U2.50
D1
  Top 0.508: U3.16 99.06,110.49 100.33,109.22 100.33,106.05 101.6,104.78 101.6,99.69 99.7,97.79 96.52,97.79 U2.48
D2  (via drill 0.61)
  Top 0.508: v87.63,90.17 v87.63,101.6
  Bottom 0.508: v87.63,101.6 87.63,114.3 88.27,114.94 99.7,114.94 U3.17 | v87.63,90.17 91.44,93.98 U2.46
D3  (via drill 0.61)
  Top 0.508: v116.84,98.42 116.84,128.27 U3.19
  Bottom 0.508: v116.84,98.42 114.94,96.52 U2.47
D4  (via drill 0.61)
  Top 0.508: v106.68,101.6 106.68,123.19 U3.20
  Bottom 0.508: U2.51 v106.68,101.6
D5  (via drill 0.61)
  Top 0.508: v105.41,104.14 105.41,120.65 99.06,127 U3.21
  Bottom 0.508: U2.53 v105.41,104.14
D6  (via drill 0.61)
  Top 0.508: v102.87,107.95 102.87,114.3 96.52,120.65 U3.22
  Bottom 0.508: v102.87,107.95 101.6,106.68 U2.54
D7  (via drill 0.61)
  Top 0.508: v101.6,109.22 100.33,110.49 100.33,114.3 95.25,119.38 95.25,125.73 93.98,127 U3.23
  Bottom 0.508: v101.6,109.22 100.33,107.95 95.89,107.95 94.62,106.68 U2.56
DMP
  Top 0.254: R16.2 28.58,104.14 28.58,100.97 D10.A
  Bottom 0.254: D10.A 13.97,99.06 P1.K2 | Q4.3 36.2,104.14 34.93,105.41 22.23,105.41 20.96,104.14 R16.2
DSP
  Top 0.254: 142.24,98.42 144.78,95.88 R28.2 | 142.24,98.42 138.43,102.23 Q8.3 | 142.24,98.42 142.24,106.68 D22.A
  Bottom 0.254: P3.13 164.47,109.22 163.2,110.49 147.32,110.49 146.05,109.22 D22.A
EM0
  Bottom 0.254: U2.15 74.3,78.74 75.57,77.47 84.46,77.47 85.09,76.83 85.09,74.3 94.62,74.3 95.25,73.66 104.14,73.66 104.14,71.75 148.59,71.75 161.29,84.45 161.29,96.52 P3.4
EM1  (via drill 0.61)
  Top 0.254: v69.85,121.28 69.85,109.85 72.39,107.31 72.39,105.41 74.3,105.41 74.93,104.78 74.93,103.5 75.57,102.87 75.57,80.01 76.2,79.38 U2.17
  Bottom 0.254: v69.85,121.28 71.76,123.19 131.45,123.19 133.99,125.73 146.69,125.73 150.5,129.54 155.58,129.54 167.01,118.11 167.01,99.69 165.1,99.69 P3.5
EM2  (via drill 0.61)
  Top 0.254: v77.47,81.28 77.47,78.11 78.74,76.83 U2.18
  Bottom 0.254: v77.47,81.28 91.44,95.25 110.49,95.25 111.13,95.88 125.1,95.88 126.37,97.16 148.59,97.16 151.77,100.33 163.2,100.33 164.47,101.6 P3.7
EM3  (via drill 0.61)
  Top 0.254: v88.9,102.23 88.9,89.53 78.74,79.38 U2.19
  Bottom 0.254: v88.9,102.23 90.17,103.5 90.17,105.41 106.05,105.41 107.95,107.31 160.02,107.31 161.93,105.41 163.2,105.41 164.47,104.14 P3.9
EWL
  Top 0.254: D25.A 132.72,120.02 132.72,120.65 Q9.3
  Bottom 0.254: Q9.3 137.8,120.65 141.61,116.84 R30.2 142.88,116.84 144.15,115.57 158.12,115.57 161.93,111.76 P3.16
GND  (via drill 0.61)
  Top 0.508: Q7.1 Q6.1 Q5.1 Q4.1 Q3.1 Q2.1 Q1.1 33.66,78.74 33.66,77.47 27.31,77.47 19.05,85.72 19.05,96.52 v15.24,100.33 v15.24,106.05 v15.24,112.39 | P2.20 P2.19 P2.17 P3.8 | P2.6 P2.8 P2.10 P2.12 P2.14 | P3.8 P3.6 162.56,98.42 163.83,97.16 | 163.83,97.16 164.47,96.52 P3.3 | P3.8 P3.10 P3.12 P3.14 162.56,109.85 163.83,111.12 163.83,116.84 | 163.83,97.16 163.83,93.34 154.94,84.45 P2.3 | Q9.1 135.26,123.19 133.99,121.92 127.64,121.92 127.64,117.47 C7.- | P3.17 P3.19 163.83,116.84 | SW1.C 162.56,128.27 P3.20 163.83,116.84 | C4.2 U2.60 88.9,106.05 90.17,104.78 90.17,80.64 88.9,79.38 U2.27 | C1.2 78.74,71.75 76.2,74.3 U2.16 | v99.06,74.93 99.06,73.66 97.79,72.39 P4.5 | C6.- 126.37,89.53 126.37,93.34 C5.- 126.37,94.61 118.75,94.61 115.57,97.79 115.57,98.42 113.03,100.97 U1.2 110.49,100.97 109.22,100.97 106.68,98.42 C3.2
  Bottom 0.508: 38.1,88.27 51.44,88.27 | 51.44,88.27 62.23,88.27 62.87,88.9 C2.2 | 38.1,88.27 37.47,87.63 36.2,87.63 | 36.2,87.63 34.93,86.36 Q2.1 | P1.C2 13.97,80.01 32.39,80.01 33.66,78.74 Q1.1 | 36.2,87.63 13.97,87.63 P1.F2 | 38.1,88.27 38.1,97.16 37.47,97.79 19.69,97.79 18.42,96.52 13.97,96.52 13.97,95.88 P1.J2 | v15.24,100.33 13.97,100.33 P1.L2 | v15.24,106.05 13.97,106.05 13.97,106.68 P1.N2 | v15.24,112.39 13.97,112.39 13.97,113.03 P1.R2 | P1.U2 13.97,124.46 14.61,125.09 19.05,125.09 19.69,125.73 32.39,125.73 33.66,124.46 Q7.1 | Q8.1 141.61,105.41 142.88,104.14 P2.20 | P2.3 154.31,83.82 152.4,85.72 P2.6 | Q9.1 136.53,123.19 138.43,125.09 147.32,125.09 150.5,128.27 SW1.C | C3.2 106.05,91.44 104.78,90.17 98.43,90.17 97.16,88.9 U2.42 88.9,88.9 85.09,85.09 82.55,85.09 82.55,80.01 | 72.39,80.01 72.39,77.47 74.3,77.47 75.57,76.2 U2.16 | 72.39,80.01 72.39,81.91 71.12,83.19 U2.8 | 72.39,80.01 82.55,80.01 | 82.55,80.01 87,80.01 88.27,78.74 U2.27 89.54,78.74 90.81,77.47 97.16,77.47 97.79,76.83 97.79,74.93 v99.06,74.93 112.4,74.93 113.67,73.66 X1.7 | C5.- P2.12 | 51.44,88.27 51.44,85.09 62.87,85.09 67.95,80.01 72.39,80.01 | U2.49 108.59,99.06 110.49,100.97 U1.2 | U3.2 61.6,114.94 61.6,119.38 97.79,119.38 U3.18 102.24,111.12 90.17,111.12 89.54,110.49 C4.2
INT_DMP
  Bottom 0.254: D11.A 62.23,92.71 71.76,92.71 72.39,92.08 72.39,89.53 71.12,89.53 U2.4
INT_DSP  (via drill 0.61)
  Top 0.508: v104.14,107.95 104.14,98.42 99.7,93.98 U2.45
  Bottom 0.508: v104.14,107.95 109.22,107.95 110.49,109.22 D23.A
INT_EWL
  Top 0.508: D26.A 107.95,120.65 107.95,100.97 99.06,92.08 U2.43
INT_NEX
  Top 0.254: D14.A 51.44,107.31 51.44,90.81 64.14,78.11 67.95,78.11 67.95,78.74 U2.11
INT_PSM  (via drill 0.61)
  Top 0.254: v66.04,85.09 66.04,88.27 56.52,97.79 56.52,100.97 54.61,102.87 54.61,104.78 55.25,105.41 55.25,114.94 D17.A
  Bottom 0.254: v66.04,85.09 67.31,83.82 U2.7
INT_T1D
  Top 0.254: 69.85,83.19 69.85,95.25 67.95,95.25 66.68,93.98 66.68,92.71 62.87,92.71 57.15,98.42 57.15,120.65 D20.A | 69.85,83.19 71.12,81.91 U2.10 | 69.85,83.19 69.85,78.11 71.12,76.83 U2.12
INT_TBD
  Bottom 0.254: D8.A 54.61,92.71 60.96,92.71 61.6,92.08 68.58,92.08 U2.1
INT_TTA  (via drill 0.61)
  Top 0.254: v63.5,80.01 67.31,83.82 67.31,92.08 68.58,93.34 U2.83
  Bottom 0.254: v63.5,80.01 55.88,80.01 54.61,78.74 D1.A
INT_TTB
  Bottom 0.254: D5.A 54.61,86.36 55.88,87.63 69.22,87.63 69.85,88.27 69.85,91.44 U2.2
INT_WFF  (via drill 0.61)
  Top 0.254: R18.2 R26.1 56.52,91.44 v61.6,86.36
  Bottom 0.254: v61.6,86.36 U2.5
INT_WTE
  Top 0.254: R27.1 R19.2
  Bottom 0.254: U2.3 67.95,88.9 65.41,91.44 R27.1
INT_X0
  Top 0.508: R1.2 125.1,73.66 121.29,69.85 101.6,69.85 101.6,85.72 99.06,88.27 U2.41
INT_X1  (via drill 0.61)
  Top 0.508: v127,83.19 133.99,76.2 R2.2
  Bottom 0.508: v127,83.19 126.37,83.82 100.97,83.82 99.7,85.09 98.43,85.09 97.16,86.36 U2.40
INT_X2  (via drill 0.61)
  Top 0.508: v105.41,85.09 105.41,72.39 122.56,72.39 123.83,73.66 123.83,74.93 135.26,74.93 135.89,75.56 135.89,76.83 134.62,78.11 R3.2
  Bottom 0.508: v105.41,85.09 104.14,86.36 U2.39
INT_X3
  Bottom 0.508: R4.2 123.83,81.28 122.56,80.01 102.24,80.01 100.97,81.28 U2.35
INT_X4  (via drill 0.61)
  Top 0.508: v132.08,80.01 132.08,80.64 134.62,83.19 R5.2
  Bottom 0.508: v132.08,80.01 130.81,78.74 U2.33
INT_X5
  Bottom 0.508: R6.2 134.62,85.72 135.89,84.45 135.89,77.47 98.43,77.47 97.16,78.74 U2.34
INT_X6  (via drill 0.61)
  Top 0.508: U2.32 v99.06,76.2
  Bottom 0.508: v99.06,76.2 112.4,76.2 113.67,74.93 137.16,74.93 137.16,85.72 134.62,88.27 R7.2
INT_X7  (via drill 0.61)
  Top 0.508: U2.31 v93.98,92.71
  Bottom 0.508: v93.98,92.71 107.32,92.71 108.59,91.44 R8.2
N$1
  Top 0.508: U2.29 90.81,78.74 89.54,77.47 87.63,77.47 P4.1
N$2
  Top 0.508: U2.28 91.44,75.56 90.17,74.3 P4.2
N$3
  Top 0.508: U2.30 93.98,73.66 95.25,72.39 P4.4
N$4
  Top 0.508: U2.59 91.44,103.5 92.71,102.23 P4.3
N$5  (via drill 0.61)
  Top 0.508: v107.95,97.79 107.95,87 115.57,87 121.29,81.28 X1.8
  Bottom 0.508: v107.95,97.79 84.46,97.79 71.76,85.09 70.49,85.09 69.85,84.45 69.85,81.91 68.58,81.91 U2.9
N$6
  Bottom 0.508: D1.C 44.45,78.74 46.99,76.2 D2.A
N$7
  Top 0.508: D2.C D3.C 36.2,76.2 | 36.2,76.2 36.2,78.74 Q1.2 | 36.2,76.2 36.2,74.93 24.77,74.93 20.96,78.74 R9.2
N$8
  Bottom 0.508: D24.A 113.03,111.76 115.57,109.22 D23.C
N$9  (via drill 0.61)
  Top 0.508: Q8.2 138.43,106.05 v140.97,108.59 143.51,111.12 146.69,111.12 146.69,101.6 144.78,99.69 R25.2
  Bottom 0.508: D24.C 123.19,111.76 125.73,109.22 D22.C 135.89,109.22 136.53,108.59 v140.97,108.59
N$10
  Bottom 0.508: D5.C 44.45,86.36 46.99,83.82 D6.A
N$11
  Top 0.508: D6.C D4.C 39.37,83.82 37.47,85.72 37.47,86.36 Q2.2
  Bottom 0.508: R11.2 20.96,86.36 22.23,85.09 34.93,85.09 36.2,86.36 Q2.2
N$12
  Bottom 0.508: D27.A 113.03,127 115.57,124.46 D26.C
N$13
  Top 0.508: D27.C D25.C | Q9.2 132.72,123.19 130.18,125.73 130.18,126.36 D25.C | R29.2 139.7,117.47 140.97,118.75 140.97,127.63 140.34,128.27 129.54,128.27 D25.C
N$14
  Bottom 0.508: D8.C 44.45,93.98 46.99,91.44 D9.A
N$15
  Top 0.508: D9.C D7.C 39.37,91.44 37.47,93.34 37.47,93.98 Q3.2
  Bottom 0.508: R13.2 20.96,93.98 22.23,92.71 34.93,92.71 36.2,93.98 Q3.2
N$16
  Bottom 0.508: U$2.C2 13.97,9.52 14.61,9.52 15.24,8.89 24.77,8.89 27.31,11.43 31.12,11.43 40.01,20.32 41.28,20.32 42.55,21.59 P6.3
N$17  (via drill 0.61)
  Top 0.508: SW1.1 R31.1 157.48,118.75 158.75,117.47 158.75,113.66 v151.13,106.05 | v95.25,74.93 v95.25,102.87
  Bottom 0.508: v95.25,74.93 88.27,74.93 87,76.2 U2.24 | v95.25,102.87 107.32,102.87 111.13,106.68 150.5,106.68 v151.13,106.05
N$18
  Bottom 0.508: D11.C 44.45,101.6 46.99,99.06 D12.A
N$19
  Top 0.508: D12.C D10.C 39.37,99.06 37.47,100.97 37.47,101.6 Q4.2
  Bottom 0.508: R15.2 20.96,101.6 22.23,100.33 34.93,100.33 36.2,101.6 Q4.2
N$20  (via drill 0.61)
  Top 0.508: R32.1 157.48,117.47 154.94,120.02 SW1.2 154.94,126.36 153.67,127.63 153.67,128.91 151.13,128.91 146.05,123.82 146.05,115.57 137.16,106.68 137.16,95.88 133.35,92.08 133.35,91.44 v124.46,82.55 | v87,81.28 87,80.01 86.36,79.38 U2.25
  Bottom 0.508: v87,81.28 88.27,82.55 v124.46,82.55
N$21  (via drill 0.61)
  Top 0.508: R33.1 157.48,114.94 152.4,120.02 SW1.4 | v50.8,73.66 49.53,74.93 v49.53,123.19 | v97.79,125.09 v104.14,118.75 | v88.9,73.03 U2.26
  Bottom 0.508: v88.9,73.03 88.27,73.66 v50.8,73.66 | v49.53,123.19 55.88,123.19 57.79,125.09 v97.79,125.09 | v104.14,118.75 109.86,113.03 155.58,113.03 156.85,114.3 R33.1
N$22
  Bottom 0.508: D14.C 44.45,109.22 46.99,106.68 D15.A
N$23
  Top 0.508: D15.C D13.C 39.37,106.68 37.47,108.59 37.47,109.22 Q5.2
  Bottom 0.508: R17.2 20.96,109.22 22.23,107.95 34.93,107.95 36.2,109.22 Q5.2
N$24
  Bottom 0.508: P5.3 34.93,160.02 33.66,158.75 26.04,158.75 13.97,147.95 13.34,147.95 U$1.C2
N$25
  Bottom 0.508: U$1.D2 13.34,151.13 13.97,151.13 23.5,159.38 24.13,160.02 P5.4
N$26
  Bottom 0.508: D17.C 44.45,116.84 46.99,114.3 D18.A
N$27
  Top 0.508: D18.C D16.C 39.37,114.3 37.47,116.2 37.47,116.84 Q6.2
  Bottom 0.508: R21.2 20.96,116.84 22.23,115.57 34.93,115.57 36.2,116.84 Q6.2
N$28
  Bottom 0.508: P5.5 34.93,162.56 33.66,161.29 21.59,161.29 13.97,154.31 U$1.E2
N$29
  Bottom 0.508: U$1.F2 13.34,157.48 13.97,157.48 20.32,162.56 P5.6
N$30
  Bottom 0.508: D20.C 44.45,124.46 46.99,121.92 D21.A
N$31
  Top 0.508: D21.C D19.C 39.37,121.92 37.47,123.82 37.47,124.46 Q7.2
  Bottom 0.508: R23.2 20.96,124.46 22.23,123.19 34.93,123.19 36.2,124.46 Q7.2
N$32
  Bottom 0.508: P5.7 34.93,165.1 33.66,163.83 18.42,163.83 13.97,160.66 13.34,160.66 U$1.H2
N$33
  Bottom 0.508: P5.8 15.24,165.1 13.97,163.83 13.34,163.83 U$1.J2
N$34
  Bottom 0.508: P5.9 34.93,167.64 33.66,166.37 13.97,166.37 U$1.K2
N$35
  Bottom 0.508: P5.10 15.88,167.64 13.97,169.55 13.34,169.55 U$1.L2
N$36
  Bottom 0.508: P5.11 34.93,170.18 33.66,168.91 19.05,168.91 13.97,172.72 13.34,172.72 U$1.M2
N$37
  Bottom 0.508: P5.12 19.69,170.18 13.97,175.89 13.34,175.89 U$1.N2
N$38
  Bottom 0.508: P5.13 34.93,172.72 33.66,171.45 22.86,171.45 13.97,179.07 13.34,179.07 U$1.P2
N$39
  Bottom 0.508: P5.14 26.04,172.72 16.51,182.25 13.34,182.25 U$1.R2
N$40
  Bottom 0.508: U$1.S2 13.34,185.42 18.42,185.42 29.85,173.99 33.66,173.99 34.93,175.26 P5.15
N$41
  Bottom 0.508: P5.16 32.39,175.26 19.05,188.59 13.34,188.59 U$1.T2
N$42
  Bottom 0.508: P5.17 34.93,177.8 33.66,179.07 31.12,179.07 18.42,191.77 13.34,191.77 U$1.U2
N$43
  Bottom 0.508: P5.19 35.56,180.97 21.59,194.94 13.97,194.94 U$1.V2
N$44
  Bottom 0.508: P6.6 40.01,24.13 37.47,21.59 14.61,21.59 13.97,20.95 U$2.F2
N$45
  Bottom 0.508: P6.8 13.97,26.67 U$2.J2
N$46
  Bottom 0.508: P6.10 32.39,29.21 31.12,30.48 23.5,30.48 20.96,33.02 13.97,33.02 U$2.L2
N$47
  Bottom 0.508: U$2.N2 13.97,39.37 31.12,39.37 36.2,34.29 37.47,34.29 40.01,31.75 P6.12
N$48
  Bottom 0.508: U$2.R2 13.97,44.45 29.85,44.45 40.01,34.29 P6.14
N$49
  Bottom 0.508: P6.19 43.18,57.78 13.97,57.78 U$2.V2
N$50
  Bottom 0.508: P6.17 43.18,40 41.91,41.27 41.91,53.97 13.97,53.97 U$2.U2
N$51
  Bottom 0.508: P6.16 40.64,37.47 37.47,40.64 37.47,50.8 13.97,50.8 U$2.T2
N$52
  Bottom 0.508: U$2.P2 13.97,41.27 30.48,41.27 36.2,35.56 37.47,35.56 40.01,33.02 41.28,33.02 42.55,34.29 P6.13
N$53
  Bottom 0.508: P6.15 43.18,35.56 40.01,35.56 35.56,40 35.56,42.55 30.48,47.62 R34.2
N$54
  Bottom 0.508: R35.2 31.12,35.56 36.2,30.48 41.28,30.48 42.55,31.75 P6.11
N$55
  Bottom 0.508: R36.2 31.12,29.21 32.39,27.94 41.28,27.94 42.55,29.21 P6.9
N$56
  Bottom 0.508: R37.2 31.12,22.86 33.66,25.4 41.28,25.4 42.55,26.67 P6.7
N$57
  Bottom 0.508: R38.2 31.12,16.51 34.93,20.32 37.47,20.32 40.01,22.86 41.28,22.86 42.55,24.13 P6.5
N$58
  Bottom 0.508: R39.2 31.12,12.7 40.01,21.59 P6.4
N$59
  Bottom 0.508: R40.1 R39.1 13.97,12.7 U$2.D2
N$60
  Bottom 0.508: R41.1 R38.1 13.97,16.51 U$2.E2
N$61
  Bottom 0.508: R42.1 R37.1 13.97,22.86 U$2.H2
N$62
  Bottom 0.508: R43.1 R36.1 13.97,29.21 U$2.K2
N$63
  Bottom 0.508: R44.1 R35.1 13.97,35.56 U$2.M2
N$64
  Bottom 0.508: R45.1 R34.1 13.97,48.26 U$2.S2
NEX  (via drill 0.61)
  Top 0.254: v33.02,111.76 33.02,109.22 D13.A
  Bottom 0.254: Q5.3 v33.02,111.76 31.75,113.03 18.42,113.03 | 18.42,113.03 15.24,116.2 13.97,116.2 P1.S2 | 18.42,113.03 19.69,111.76 R20.2
OE\  (via drill 0.61)
  Top 0.508: v82.55,109.22 82.55,123.19 86.36,127 U3.26
  Bottom 0.508: v82.55,109.22 82.55,107.31 81.28,107.31 U2.66
PSM
  Top 0.254: D16.A 21.59,114.3 21.59,117.47 20.32,118.75 R22.2
  Bottom 0.254: 20.32,120.65 13.97,120.65 P1.T2 | 20.32,120.65 34.93,120.65 36.2,119.38 Q6.3 | 20.32,120.65 R22.2
T1D
  Top 0.254: 33.66,125.73 34.93,127 Q7.3 | 33.66,125.73 33.02,125.09 33.02,124.46 D19.A | 33.66,125.73 31.12,128.27 20.32,128.27 R24.2
  Bottom 0.254: R24.2 13.97,127 P1.V2
TBD
  Bottom 0.254: 18.42,95.25 15.88,92.71 13.97,92.71 P1.H2 13.97,91.44 D7.A | 18.42,95.25 19.69,96.52 R14.2 | 18.42,95.25 34.93,95.25 36.2,96.52 Q3.3
TTA
  Top 0.254: Q1.3 36.83,80.64 35.56,79.38 35.56,76.2 D3.A 24.77,76.2 20.32,80.64 R10.2
  Bottom 0.254: R10.2 13.97,81.28 P1.D2
TTB
  Top 0.254: R12.2 29.21,88.9 29.21,83.82 D4.A
  Bottom 0.254: D4.A 29.21,83.82 28.58,84.45 13.97,84.45 P1.E2 | Q2.3 36.2,88.9 34.93,90.17 22.23,90.17 20.96,88.9 R12.2
VCC  (via drill 0.61)
  Top 0.508: 83.82,74.3 C1.1 | 83.82,74.3 U2.22 83.82,76.83 85.09,78.11 v85.09,81.28 | U2.64 C4.1 | 71.76,101.6 73.66,103.5 U2.73 | 83.82,74.3 77.47,74.3 77.47,76.83 76.84,77.47 74.93,77.47 74.93,98.42 71.76,101.6 | 71.76,101.6 U2.78 | 97.79,83.19 98.43,82.55 100.33,82.55 P4.6 | 97.79,83.19 97.16,83.82 U2.38 | 102.24,90.17 106.05,86.36 C3.1 X1.14 | 102.24,90.17 97.79,90.17 97.79,83.19 | R31.2 R32.2 R33.2 147.32,113.66 147.96,113.03 v147.96,100.33 | U1.3 111.13,98.42 111.13,94.61 C5.+ | U3.36 60.96,127 59.69,125.73 59.69,98.42 63.5,94.61 C2.1 | 102.24,90.17 105.41,93.34 v105.41,93.98
  Bottom 0.508: C2.1 64.14,93.98 67.95,97.79 69.22,97.79 69.85,98.42 69.85,101.6 U2.78 71.12,102.23 82.55,102.23 82.55,104.78 83.82,106.05 U2.64 | v147.96,100.33 145.42,97.79 119.38,97.79 117.48,99.69 113.03,99.69 U1.3 | v85.09,81.28 87.63,83.82 U2.38 | v105.41,93.98 C5.+
VDD
  Top 0.508: R45.2 R44.2 29.21,36.83 29.21,31.75 | R40.2 29.21,11.43 29.21,19.05 | 29.21,19.05 R41.2 | 29.21,25.4 R42.2 | 29.21,25.4 29.21,19.05 | 29.21,31.75 R43.2 | 29.21,31.75 29.21,25.4
  Bottom 0.508: U$2.A2 13.97,5.08 14.61,5.71 25.4,5.71 29.85,10.16 R40.2
WE\  (via drill 0.61)
  Top 0.508: v62.23,106.68 v62.23,126.36
  Bottom 0.508: v62.23,126.36 71.76,126.36 U3.31 | v62.23,106.68 64.77,104.14 U2.75
WFF
  Bottom 0.254: R18.1 55.88,110.49 13.97,110.49 P1.P2
WLO  (via drill 0.61)
  Top 0.254: v83.82,82.55 83.82,81.91 81.28,79.38 U2.21 | v133.35,85.09 143.51,85.09 143.51,73.03 144.15,72.39 166.37,72.39 166.37,109.85 165.1,111.12 P3.15
  Bottom 0.254: v83.82,82.55 88.9,87.63 109.22,87.63 111.76,85.09 v133.35,85.09
WTE
  Bottom 0.254: R19.1 57.79,104.14 56.52,102.87 14.61,102.87 13.97,103.5 P1.M2
X0
  Top 0.254: R1.1 144.78,74.3 151.13,80.64 151.13,81.91 152.4,83.19 P2.4
X1
  Bottom 0.254: R2.1 145.42,76.2 151.77,82.55 155.58,82.55 156.21,83.19 156.21,85.72 154.94,85.72 P2.5
X2
  Bottom 0.254: R3.1 144.78,79.38 151.13,85.72 151.13,87.63 153.04,87.63 154.31,88.9 P2.7
X3
  Top 0.254: R4.1 150.5,81.28 150.5,83.82 151.77,85.09 153.67,85.09 153.67,89.53 154.94,90.81 P2.9
X4
  Bottom 0.254: R5.1 144.78,84.45 143.51,85.72 143.51,92.71 153.04,92.71 154.31,93.98 P2.11
X5
  Top 0.254: R6.1 144.78,87 151.13,93.34 151.13,97.16 151.77,97.79 154.94,97.79 P2.13
X6
  Top 0.254: R7.1 144.78,89.53 150.5,95.25 150.5,99.06 151.77,100.33 154.31,100.33 154.31,99.06 P2.15
X7
  Bottom 0.254: R8.1 145.42,91.44 146.69,90.17 155.58,90.17 156.21,90.81 156.21,97.79 154.31,97.79 153.04,99.06 P2.16

### Text on the board
Top: Connect to P2 | Connect to P3
Bottom: Connect to P2 | Connect to P3